# Altium schematic sheet 21.SchDoc
size 297 x 209 mm
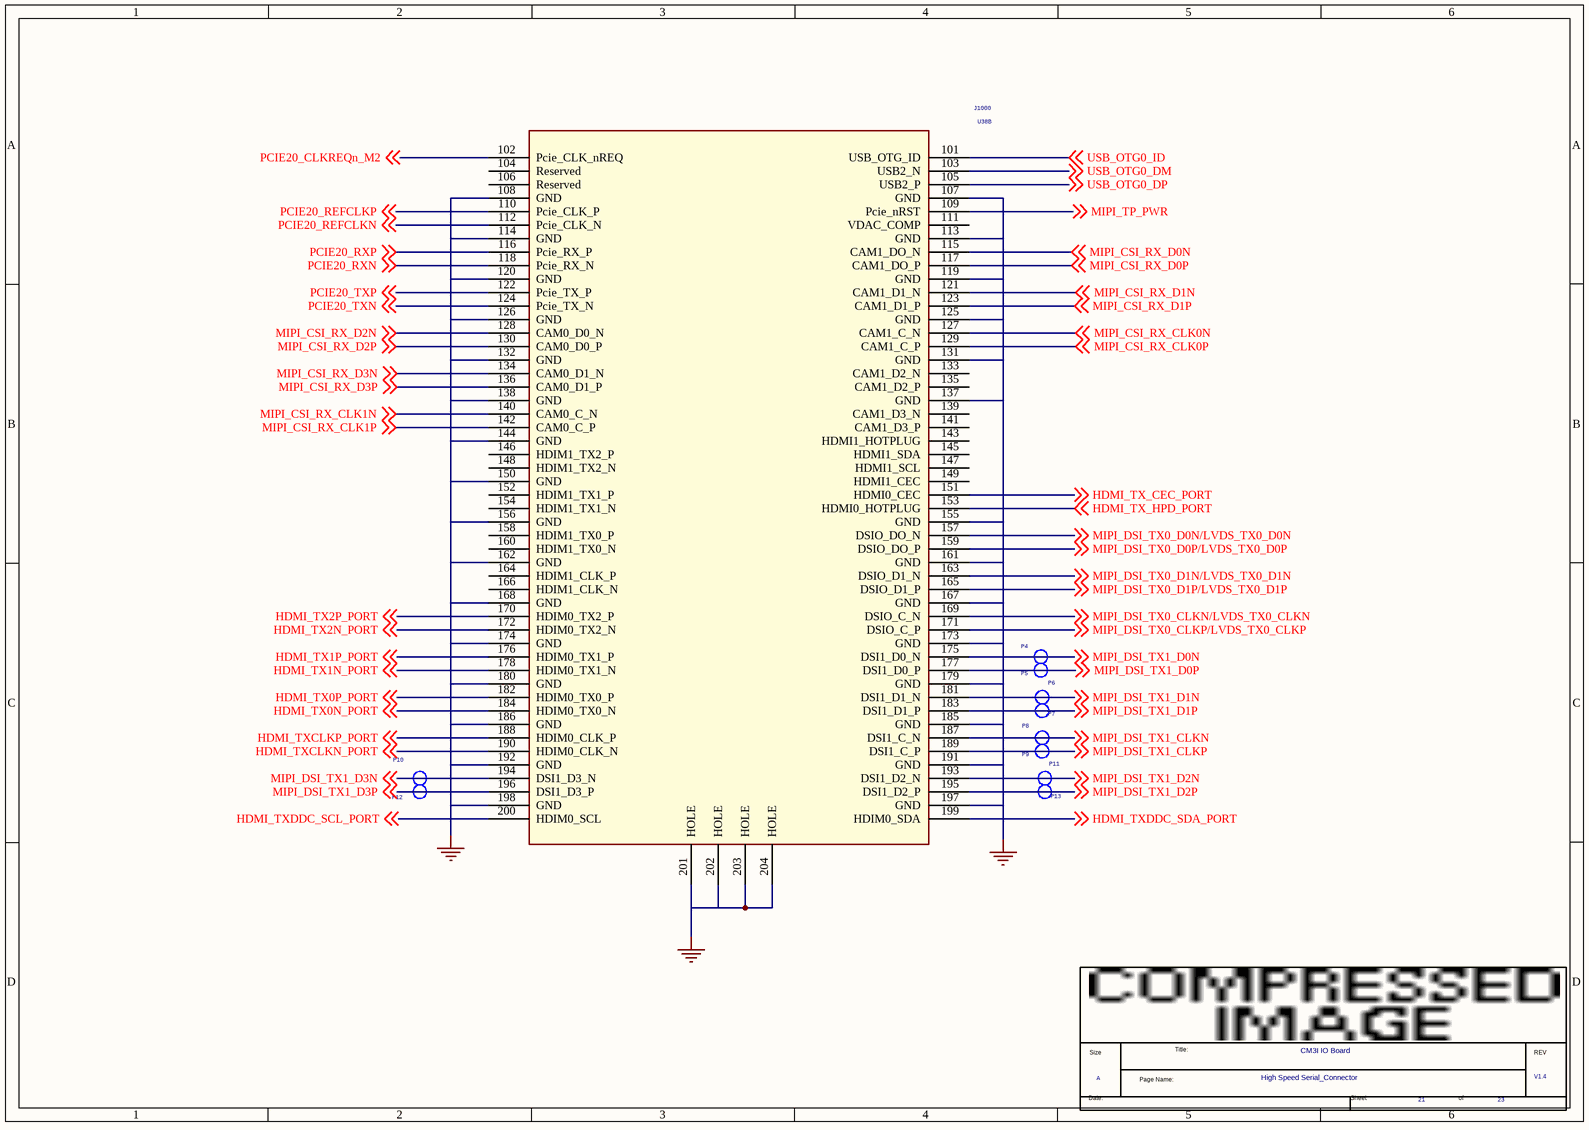
[diagram p0: 21.SchDoc]

## Parts
*  Page Count: 23  Page Number: 21  Page Size: A  Title: CM3I IO Board  RevCode: V1.4  Doc: High Speed Serial_Connector  (hidden comment: radxa_1010)  (graphical)
P4  TEST  [TEST]  (value not drawn)
P5  TEST  [TEST]  (value not drawn)
P6  TEST  [TEST]  (value not drawn)
P7  TEST  [TEST]  (value not drawn)
P8  TEST  [TEST]  (value not drawn)
P9  TEST  [TEST]  (value not drawn)
P10  TEST  [TEST]  (value not drawn)
P11  TEST  [TEST]  (value not drawn)
P12  TEST  [TEST]  (value not drawn)
P13  TEST  [TEST]  (value not drawn)
U38  J1000  [DF40C-200DS-70X40_MZ_3D5]  (part B of 2)

## Nets
GND: U38.107(GND) U38.108(GND) U38.113(GND) U38.114(GND) U38.119(GND) U38.120(GND) U38.125(GND) U38.126(GND) U38.131(GND) U38.132(GND) U38.137(GND) U38.138(GND) U38.144(GND) U38.150(GND) U38.155(GND) U38.156(GND) U38.161(GND) U38.162(GND) U38.167(GND) U38.168(GND) U38.173(GND) U38.174(GND) U38.179(GND) U38.180(GND) U38.185(GND) U38.186(GND) U38.191(GND) U38.192(GND) U38.197(GND) U38.198(GND) U38.201(HOLE) U38.202(HOLE) U38.203(HOLE) U38.204(HOLE)
HDMI_TX0N_PORT: U38.184(HDIM0_TX0_N) ; off-sheet HDMI_TX0N_PORT
HDMI_TX0P_PORT: U38.182(HDIM0_TX0_P) ; off-sheet HDMI_TX0P_PORT
HDMI_TX1N_PORT: U38.178(HDIM0_TX1_N) ; off-sheet HDMI_TX1N_PORT
HDMI_TX1P_PORT: U38.176(HDIM0_TX1_P) ; off-sheet HDMI_TX1P_PORT
HDMI_TX2N_PORT: U38.172(HDIM0_TX2_N) ; off-sheet HDMI_TX2N_PORT
HDMI_TX2P_PORT: U38.170(HDIM0_TX2_P) ; off-sheet HDMI_TX2P_PORT
HDMI_TX_CEC_PORT: U38.151(HDMI0_CEC) ; off-sheet HDMI_TX_CEC_PORT
HDMI_TX_HPD_PORT: U38.153(HDMI0_HOTPLUG) ; off-sheet HDMI_TX_HPD_PORT
HDMI_TXCLKN_PORT: U38.190(HDIM0_CLK_N) ; off-sheet HDMI_TXCLKN_PORT
HDMI_TXCLKP_PORT: U38.188(HDIM0_CLK_P) ; off-sheet HDMI_TXCLKP_PORT
HDMI_TXDDC_SCL_PORT: U38.200(HDIM0_SCL) ; off-sheet HDMI_TXDDC_SCL_PORT
HDMI_TXDDC_SDA_PORT: U38.199(HDIM0_SDA) ; off-sheet HDMI_TXDDC_SDA_PORT
MIPI_CSI_RX_CLK0N: U38.127(CAM1_C_N) ; off-sheet MIPI_CSI_RX_CLK0N
MIPI_CSI_RX_CLK0P: U38.129(CAM1_C_P) ; off-sheet MIPI_CSI_RX_CLK0P
MIPI_CSI_RX_CLK1N: U38.140(CAM0_C_N) ; off-sheet MIPI_CSI_RX_CLK1N
MIPI_CSI_RX_CLK1P: U38.142(CAM0_C_P) ; off-sheet MIPI_CSI_RX_CLK1P
MIPI_CSI_RX_D0N: U38.115(CAM1_DO_N) ; off-sheet MIPI_CSI_RX_D0N
MIPI_CSI_RX_D0P: U38.117(CAM1_DO_P) ; off-sheet MIPI_CSI_RX_D0P
MIPI_CSI_RX_D1N: U38.121(CAM1_D1_N) ; off-sheet MIPI_CSI_RX_D1N
MIPI_CSI_RX_D1P: U38.123(CAM1_D1_P) ; off-sheet MIPI_CSI_RX_D1P
MIPI_CSI_RX_D2N: U38.128(CAM0_D0_N) ; off-sheet MIPI_CSI_RX_D2N
MIPI_CSI_RX_D2P: U38.130(CAM0_D0_P) ; off-sheet MIPI_CSI_RX_D2P
MIPI_CSI_RX_D3N: U38.134(CAM0_D1_N) ; off-sheet MIPI_CSI_RX_D3N
MIPI_CSI_RX_D3P: U38.136(CAM0_D1_P) ; off-sheet MIPI_CSI_RX_D3P
MIPI_DSI_TX0_CLKN/LVDS_TX0_CLKN: U38.169(DSIO_C_N) ; off-sheet MIPI_DSI_TX0_CLKN/LVDS_TX0_CLKN
MIPI_DSI_TX0_CLKP/LVDS_TX0_CLKP: U38.171(DSIO_C_P) ; off-sheet MIPI_DSI_TX0_CLKP/LVDS_TX0_CLKP
MIPI_DSI_TX0_D0N/LVDS_TX0_D0N: U38.157(DSIO_DO_N) ; off-sheet MIPI_DSI_TX0_D0N/LVDS_TX0_D0N
MIPI_DSI_TX0_D0P/LVDS_TX0_D0P: U38.159(DSIO_DO_P) ; off-sheet MIPI_DSI_TX0_D0P/LVDS_TX0_D0P
MIPI_DSI_TX0_D1N/LVDS_TX0_D1N: U38.163(DSIO_D1_N) ; off-sheet MIPI_DSI_TX0_D1N/LVDS_TX0_D1N
MIPI_DSI_TX0_D1P/LVDS_TX0_D1P: U38.165(DSIO_D1_P) ; off-sheet MIPI_DSI_TX0_D1P/LVDS_TX0_D1P
MIPI_DSI_TX1_CLKN: P8.1 U38.187(DSI1_C_N) ; off-sheet MIPI_DSI_TX1_CLKN
MIPI_DSI_TX1_CLKP: P9.1 U38.189(DSI1_C_P) ; off-sheet MIPI_DSI_TX1_CLKP
MIPI_DSI_TX1_D0N: P4.1 U38.175(DSI1_D0_N) ; off-sheet MIPI_DSI_TX1_D0N
MIPI_DSI_TX1_D0P: P5.1 U38.177(DSI1_D0_P) ; off-sheet MIPI_DSI_TX1_D0P
MIPI_DSI_TX1_D1N: P6.1 U38.181(DSI1_D1_N) ; off-sheet MIPI_DSI_TX1_D1N
MIPI_DSI_TX1_D1P: P7.1 U38.183(DSI1_D1_P) ; off-sheet MIPI_DSI_TX1_D1P
MIPI_DSI_TX1_D2N: P11.1 U38.193(DSI1_D2_N) ; off-sheet MIPI_DSI_TX1_D2N
MIPI_DSI_TX1_D2P: P13.1 U38.195(DSI1_D2_P) ; off-sheet MIPI_DSI_TX1_D2P
MIPI_DSI_TX1_D3N: P10.1 U38.194(DSI1_D3_N) ; off-sheet MIPI_DSI_TX1_D3N
MIPI_DSI_TX1_D3P: P12.1 U38.196(DSI1_D3_P) ; off-sheet MIPI_DSI_TX1_D3P
MIPI_TP_PWR: U38.109(Pcie_nRST) ; off-sheet MIPI_TP_PWR
PCIE20_CLKREQn_M2: U38.102(Pcie_CLK_nREQ) ; off-sheet PCIE20_CLKREQn_M2
PCIE20_REFCLKN: U38.112(Pcie_CLK_N) ; off-sheet PCIE20_REFCLKN
PCIE20_REFCLKP: U38.110(Pcie_CLK_P) ; off-sheet PCIE20_REFCLKP
PCIE20_RXN: U38.118(Pcie_RX_N) ; off-sheet PCIE20_RXN
PCIE20_RXP: U38.116(Pcie_RX_P) ; off-sheet PCIE20_RXP
PCIE20_TXN: U38.124(Pcie_TX_N) ; off-sheet PCIE20_TXN
PCIE20_TXP: U38.122(Pcie_TX_P) ; off-sheet PCIE20_TXP
USB_OTG0_DM: U38.103(USB2_N) ; off-sheet USB_OTG0_DM
USB_OTG0_DP: U38.105(USB2_P) ; off-sheet USB_OTG0_DP
USB_OTG0_ID: U38.101(USB_OTG_ID) ; off-sheet USB_OTG0_ID

Not connected (* = marked no-connect by the designer): U38 104(Reserved) 106(Reserved) 111(VDAC_COMP) 133(CAM1_D2_N) 135(CAM1_D2_P) 139(CAM1_D3_N) 141(CAM1_D3_P) 143(HDMI1_HOTPLUG) 145(HDMI1_SDA) 146(HDIM1_TX2_P) 147(HDMI1_SCL) 148(HDIM1_TX2_N) 149(HDMI1_CEC) 152(HDIM1_TX1_P) 154(HDIM1_TX1_N) 158(HDIM1_TX0_P) 160(HDIM1_TX0_N) 164(HDIM1_CLK_P) 166(HDIM1_CLK_N)

## Notes on the sheet
- (in symbol radxa_1010) Title:; Size; REV; Page Name:; Date:; Sheet; of

## Library data of the parts
P4-P13 = TESTPOINT1
U38 = HETER_4
* = radxa_1010: Page Create Date: March  8, 1995